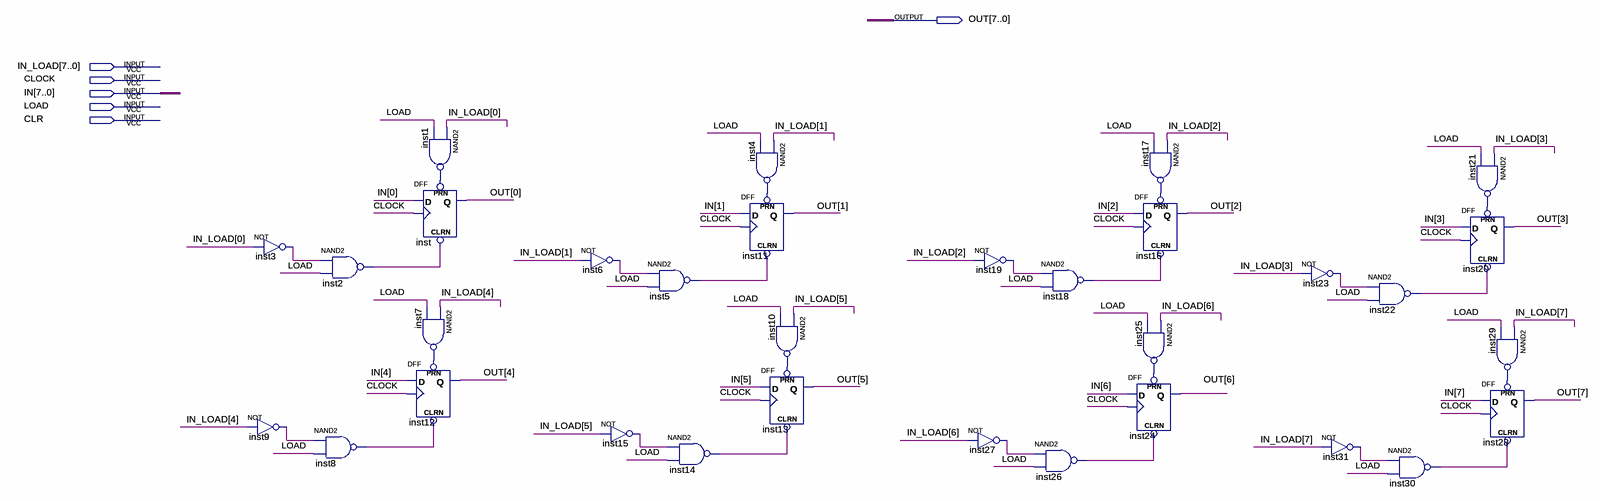
[diagram p0: schematic sheet]
// Quartus schematic REGISTRADOR_8bit.bdf as structural Verilog: 64 symbols, 12 pins
module REGISTRADOR_8bit (
  input  [7:0] IN_LOAD,
  input  CLOCK,
  input  [7:0] IN,
  input  LOAD,
  input  CLR,
  output [7:0] OUT
);

  wire inst1_out, inst2_out, inst3_out, inst4_out, inst5_out, inst6_out, inst7_out, inst8_out, inst9_out,
       inst10_out, inst14_out, inst15_out, inst17_out, inst18_out, inst19_out, inst21_out, inst22_out,
       inst23_out, inst25_out, inst26_out, inst27_out, inst29_out, inst30_out, inst31_out;

  not inst3 (inst3_out, IN_LOAD[0]);
  not inst3_dup2 (inst3_out, IN_LOAD[0]);
  not inst9 (inst9_out, IN_LOAD[4]);
  not inst9_dup2 (inst9_out, IN_LOAD[4]);
  nand inst2 (inst2_out, inst3_out, LOAD);
  nand inst2_dup2 (inst2_out, inst3_out, LOAD);
  nand inst8 (inst8_out, inst9_out, LOAD);
  nand inst8_dup2 (inst8_out, inst9_out, LOAD);
  nand inst1 (inst1_out, IN_LOAD[0], LOAD);
  nand inst1_dup2 (inst1_out, IN_LOAD[0], LOAD);
  DFF inst (.CLRN(inst2_out), .CLK(CLOCK), .D(IN[0]), .PRN(inst1_out), .Q(OUT[0]));
  DFF inst_dup2 (.CLRN(inst2_out), .CLK(CLOCK), .D(IN[0]), .PRN(inst1_out), .Q(OUT[0]));
  nand inst7 (inst7_out, IN_LOAD[4], LOAD);
  nand inst7_dup2 (inst7_out, IN_LOAD[4], LOAD);
  DFF inst12 (.CLRN(inst8_out), .CLK(CLOCK), .D(IN[4]), .PRN(inst7_out), .Q(OUT[4]));
  DFF inst12_dup2 (.CLRN(inst8_out), .CLK(CLOCK), .D(IN[4]), .PRN(inst7_out), .Q(OUT[4]));
  not inst6 (inst6_out, IN_LOAD[1]);
  not inst6_dup2 (inst6_out, IN_LOAD[1]);
  not inst15 (inst15_out, IN_LOAD[5]);
  not inst15_dup2 (inst15_out, IN_LOAD[5]);
  nand inst5 (inst5_out, inst6_out, LOAD);
  nand inst5_dup2 (inst5_out, inst6_out, LOAD);
  nand inst14 (inst14_out, inst15_out, LOAD);
  nand inst14_dup2 (inst14_out, inst15_out, LOAD);
  nand inst4 (inst4_out, IN_LOAD[1], LOAD);
  nand inst4_dup2 (inst4_out, IN_LOAD[1], LOAD);
  DFF inst11 (.CLRN(inst5_out), .CLK(CLOCK), .D(IN[1]), .PRN(inst4_out), .Q(OUT[1]));
  DFF inst11_dup2 (.CLRN(inst5_out), .CLK(CLOCK), .D(IN[1]), .PRN(inst4_out), .Q(OUT[1]));
  nand inst10 (inst10_out, IN_LOAD[5], LOAD);
  nand inst10_dup2 (inst10_out, IN_LOAD[5], LOAD);
  DFF inst13 (.CLRN(inst14_out), .CLK(CLOCK), .D(IN[5]), .PRN(inst10_out), .Q(OUT[5]));
  DFF inst13_dup2 (.CLRN(inst14_out), .CLK(CLOCK), .D(IN[5]), .PRN(inst10_out), .Q(OUT[5]));
  not inst19 (inst19_out, IN_LOAD[2]);
  not inst19_dup2 (inst19_out, IN_LOAD[2]);
  not inst27 (inst27_out, IN_LOAD[6]);
  not inst27_dup2 (inst27_out, IN_LOAD[6]);
  nand inst26 (inst26_out, inst27_out, LOAD);
  nand inst26_dup2 (inst26_out, inst27_out, LOAD);
  nand inst18 (inst18_out, inst19_out, LOAD);
  nand inst18_dup2 (inst18_out, inst19_out, LOAD);
  nand inst17 (inst17_out, IN_LOAD[2], LOAD);
  nand inst17_dup2 (inst17_out, IN_LOAD[2], LOAD);
  DFF inst16 (.CLRN(inst18_out), .CLK(CLOCK), .D(IN[2]), .PRN(inst17_out), .Q(OUT[2]));
  DFF inst16_dup2 (.CLRN(inst18_out), .CLK(CLOCK), .D(IN[2]), .PRN(inst17_out), .Q(OUT[2]));
  nand inst25 (inst25_out, IN_LOAD[6], LOAD);
  nand inst25_dup2 (inst25_out, IN_LOAD[6], LOAD);
  DFF inst24 (.CLRN(inst26_out), .CLK(CLOCK), .D(IN[6]), .PRN(inst25_out), .Q(OUT[6]));
  DFF inst24_dup2 (.CLRN(inst26_out), .CLK(CLOCK), .D(IN[6]), .PRN(inst25_out), .Q(OUT[6]));
  not inst23 (inst23_out, IN_LOAD[3]);
  not inst23_dup2 (inst23_out, IN_LOAD[3]);
  not inst31 (inst31_out, IN_LOAD[7]);
  not inst31_dup2 (inst31_out, IN_LOAD[7]);
  nand inst22 (inst22_out, inst23_out, LOAD);
  nand inst22_dup2 (inst22_out, inst23_out, LOAD);
  nand inst30 (inst30_out, inst31_out, LOAD);
  nand inst30_dup2 (inst30_out, inst31_out, LOAD);
  DFF inst20 (.CLRN(inst22_out), .CLK(CLOCK), .D(IN[3]), .PRN(inst21_out), .Q(OUT[3]));
  DFF inst20_dup2 (.CLRN(inst22_out), .CLK(CLOCK), .D(IN[3]), .PRN(inst21_out), .Q(OUT[3]));
  nand inst21 (inst21_out, IN_LOAD[3], LOAD);
  nand inst21_dup2 (inst21_out, IN_LOAD[3], LOAD);
  nand inst29 (inst29_out, IN_LOAD[7], LOAD);
  nand inst29_dup2 (inst29_out, IN_LOAD[7], LOAD);
  DFF inst28 (.CLRN(inst30_out), .CLK(CLOCK), .D(IN[7]), .PRN(inst29_out), .Q(OUT[7]));
  DFF inst28_dup2 (.CLRN(inst30_out), .CLK(CLOCK), .D(IN[7]), .PRN(inst29_out), .Q(OUT[7]));
endmodule
